# EAGLE board h4k1 (EAGLE 7.2.0), part 1 of 2
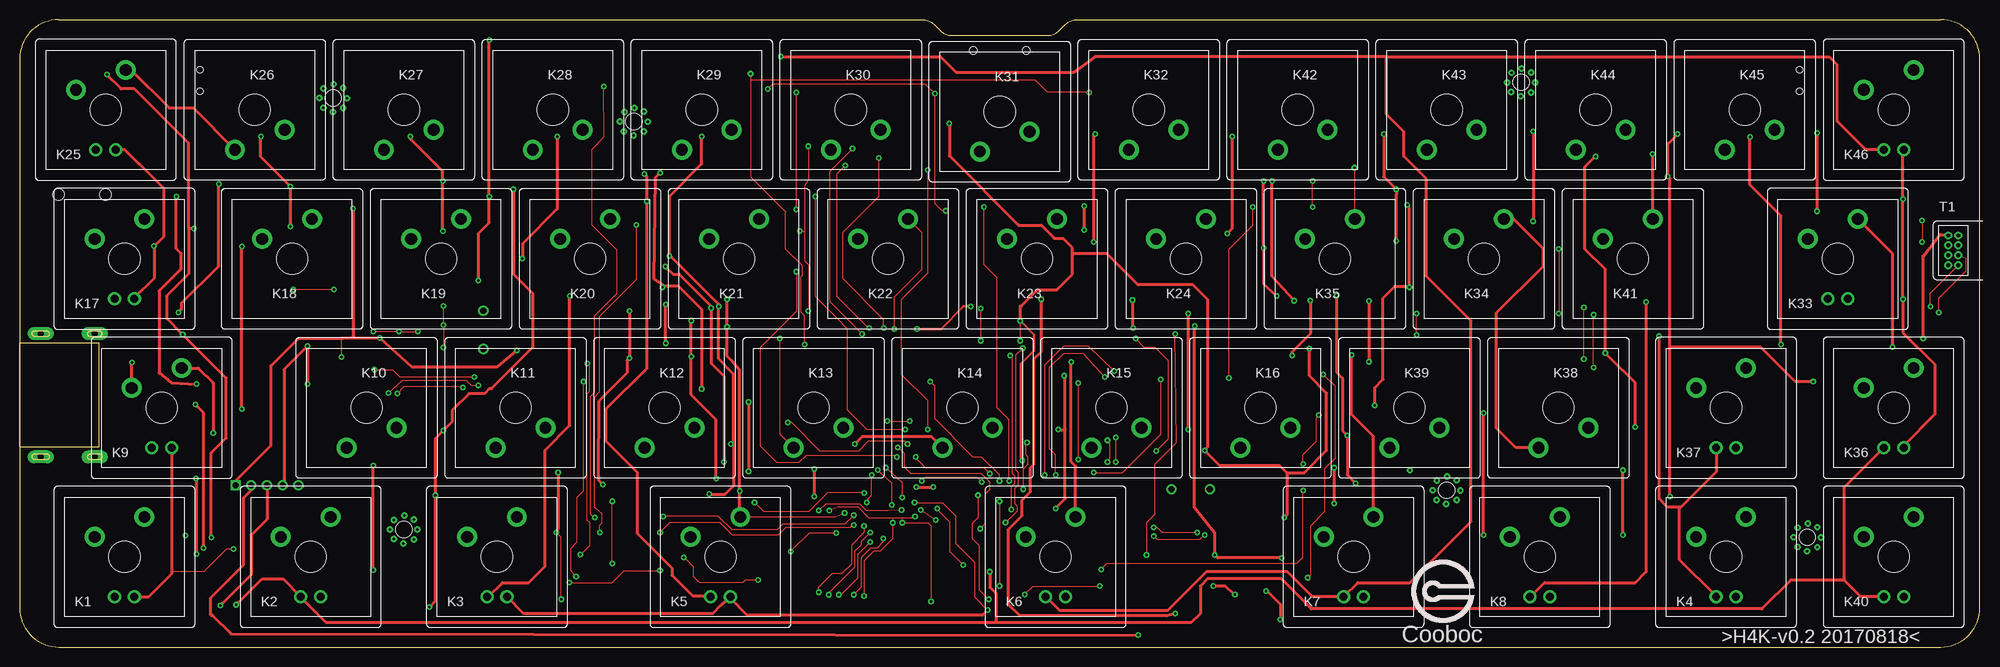
[diagram p5: board, top side]
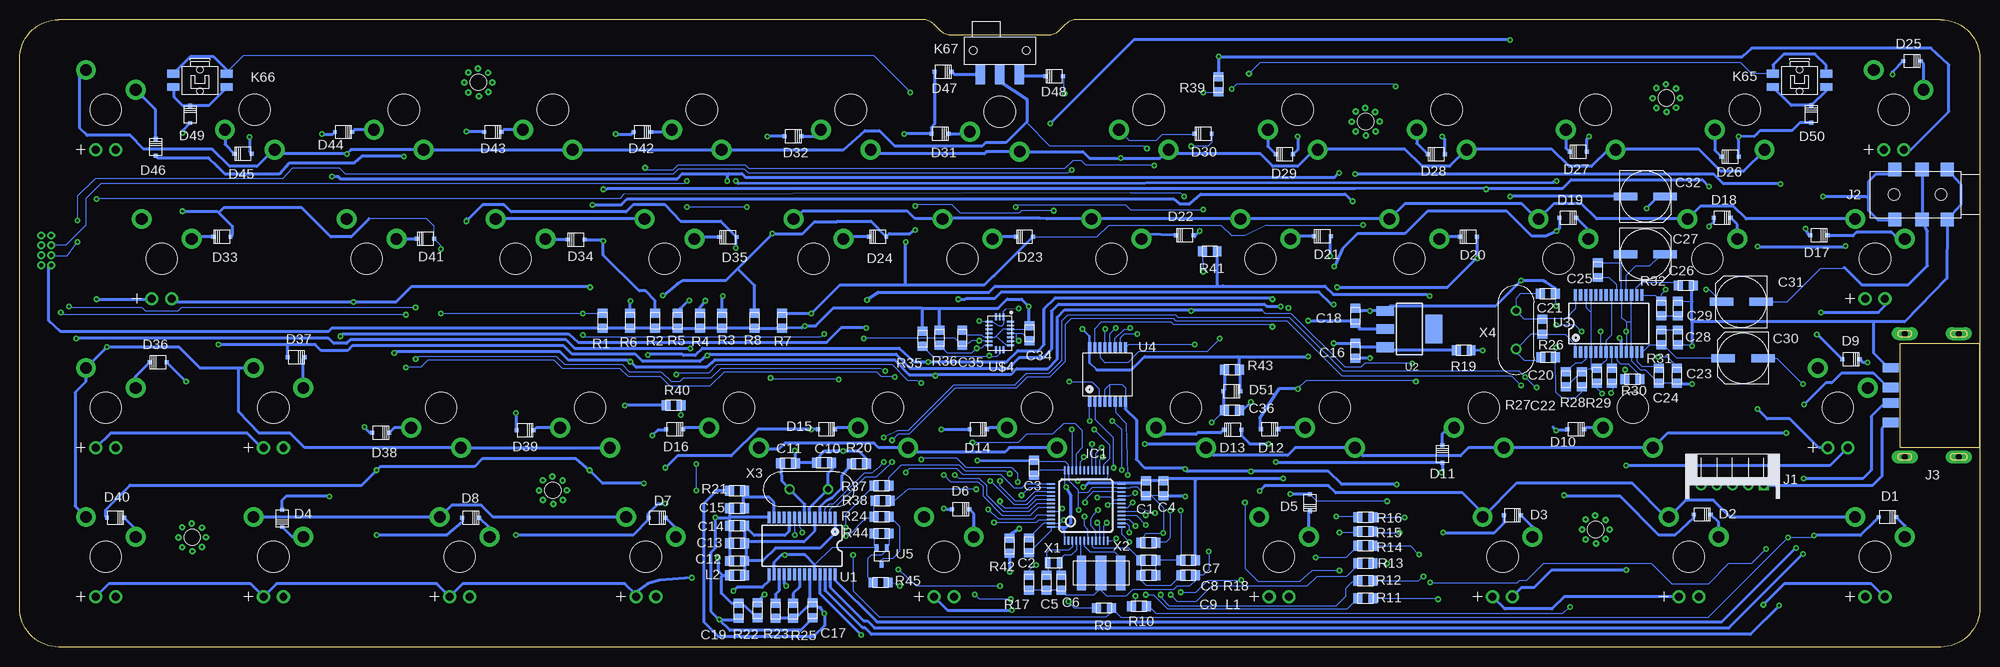
[diagram p6: board, bottom side, seen from below]

Size 250 x 80 mm. Coordinates in mm from the lower left corner, seen from the top.
Outline: 0,75 0,5 arc90 5,0 245,0 arc90 250,5 250,75 arc90 245,80 134.83,80 arc45 133.41,79.41 132.59,78.59 arc-45 131.17,78 118.83,78 arc-45 117.41,78.59 116.59,79.41 arc45 115.17,80 5,80 arc90 0,75
Copper layers (1*16): Top 0.035mm / dielectric 1.5mm / Bottom 0.035mm
Design rules "szjlc": minimum track width 4mil, minimum drill 0.3mm, track to track 6mil, track to pad 6mil, pad to pad 6mil, via to via 6mil, smd to smd 6mil, copper to edge 40mil, drill to drill 8mil, minimum pad ring 10mil, minimum via ring 8mil, stop-mask expansion 4mil, vias tented up to drill 12mil, thermal gap 10mil
Net classes: 0 default: clearance 0.205 mm

## Footprints (pad centres in the part's own frame; a part is rotated, then mirrored left to right if it is on the bottom)
0805 = smd 1.143 x 1.27: P$1 -0.953,0; P$2 0.953,0
CPOL-6.3X5.4 = smd 1 x 3: P$1 0,2.54; P$2 0,-2.54
SOD-323 = smd 0.5 x 0.5: P$1 -1.1,0; P$2 1.1,0
TQFP48 = smd 0.2 x 1: 1 -2.75,-4.5; 2 -2.25,-4.5; 3 -1.75,-4.5; 4 -1.25,-4.5; 5 -0.75,-4.5; 6 -0.25,-4.5; 7 0.25,-4.5; 8 0.75,-4.5; 9 1.25,-4.5; 10 1.75,-4.5; 11 2.25,-4.5; 12 2.75,-4.5; 25 2.75,4.5; 26 2.25,4.5; 27 1.75,4.5; 28 1.25,4.5; 29 0.75,4.5; 30 0.25,4.5; 31 -0.25,4.5; 32 -0.75,4.5; 33 -1.25,4.5; 34 -1.75,4.5; 35 -2.25,4.5; 36 -2.75,4.5 | smd 1 x 0.2: 13 4.5,-2.75; 14 4.5,-2.25; 15 4.5,-1.75; 16 4.5,-1.25; 17 4.5,-0.75; 18 4.5,-0.25; 19 4.5,0.25; 20 4.5,0.75; 21 4.5,1.25; 22 4.5,1.75; 23 4.5,2.25; 24 4.5,2.75; 37 -4.5,2.75; 38 -4.5,2.25; 39 -4.5,1.75; 40 -4.5,1.25; 41 -4.5,0.75; 42 -4.5,0.25; 43 -4.5,-0.25; 44 -4.5,-0.75; 45 -4.5,-1.25; 46 -4.5,-1.75; 47 -4.5,-2.25; 48 -4.5,-2.75
PH-5AWD = drill 0.8 square: P$1 0,4 | drill 0.8: P$2 0,2; P$3 0,0; P$4 0,-2; P$5 0,-4
PJ-313D = smd 1.7 x 1.7: P1 -0.8,-3.2; P1@2 -0.8,3.2; P2 2.4,-3.2; P2@2 2.4,3.2; P3 5.9,-3.2; P3@2 5.9,3.2 | hole 1.5: 0,0; 6,0
USB-AF10 = smd 1.2 x 2: P$D+ 1,11.37; P$D- -1,11.37; P$G 3.5,11.37; P$V -3.5,11.37 | drill 0.8 pad 1.676 long: PS@1 -7.85,2.7; PS@2 7.85,2.7; PS@3 -7.85,9.59; PS@4 7.85,9.59
CHERRY-MX-LED = drill 1.016 pad 1.676: LED_N -1.27,-5.08; LED_P 1.27,-5.08 | drill 1.5 pad 2.54: SW1 -3.81,2.54; SW2 2.54,5.08 | hole 4: 0,0
CHERRY-MX = drill 1.5 pad 2.54: SW1 -3.81,2.54; SW2 2.54,5.08 | hole 4: 0,0
EVQPUL = smd 1.55 x 1: P$1 3.4,0.85; P$2 3.4,-0.85; P$3 -3.4,0.85; P$4 -3.4,-0.85 | hole 0.8: 0,1.375; 0,-1.375
K3-1280S-F2 = smd 1.2 x 2.45: P$1 -2.5,-3.075; P$2 0,-3.075; P$3 2.5,-3.075 | hole 1: -3.4,0; 3.4,0
CLIP-8P-1.27 = drill 0.5: P$1 0,-1.27; P$2 1.27,-1.27; P$3 2.54,-1.27; P$4 3.81,-1.27; P$5 0,0; P$6 1.27,0; P$7 2.54,0; P$8 3.81,0
SSOP28 = smd 0.4 x 1.5: 1 -4.225,-3.625; 2 -3.575,-3.625; 3 -2.925,-3.625; 4 -2.275,-3.625; 5 -1.625,-3.625; 6 -0.975,-3.625; 7 -0.325,-3.625; 8 0.325,-3.625; 9 0.975,-3.625; 10 1.625,-3.625; 11 2.275,-3.625; 12 2.925,-3.625; 13 3.575,-3.625; 14 4.225,-3.625; 15 4.225,3.625; 16 3.575,3.625; 17 2.925,3.625; 18 2.275,3.625; 19 1.625,3.625; 20 0.975,3.625; 21 0.325,3.625; 22 -0.325,3.625; 23 -0.975,3.625; 24 -1.625,3.625; 25 -2.275,3.625; 26 -2.925,3.625; 27 -3.575,3.625; 28 -4.225,3.625
SOT223 = smd 1.219 x 2.235: 1 -2.311,-3.099; 2 0,-3.099; 3 2.311,-3.099 | smd 3.6 x 2.2: 4 0,3.099
SSOP16-208MIL = smd 0.4 x 1.4: P$1 -2.275,-3.4; P$2 -1.625,-3.4; P$3 -0.975,-3.4; P$4 -0.325,-3.4; P$5 0.325,-3.4; P$6 0.975,-3.4; P$7 1.625,-3.4; P$8 2.275,-3.4; P$9 2.275,3.4; P$10 1.625,3.4; P$11 0.975,3.4; P$12 0.325,3.4; P$13 -0.325,3.4; P$14 -0.975,3.4; P$15 -1.625,3.4; P$16 -2.275,3.4
SOT-323 = smd 0.5 x 0.8: P$1 -0.65,-1.1; P$2 0.65,-1.1; P$3 0,1.1
M2-MOUNTING-HOLE = drill 0.305: P$1 0.051,1.753; P$2 1.753,-0.025; P$3 1.27,1.27; P$4 1.27,-1.27; P$5 -0.051,-1.778; P$6 -1.27,-1.245; P$7 -1.778,0; P$8 -1.245,1.219 | hole 2.1: 0,0
BMX055 = smd 0.875 x 0.25: P$1 1.363,1.5; P$2 1.363,1; P$3 1.363,0.5; P$4 1.363,0; P$5 1.363,-0.5; P$6 1.363,-1; P$7 1.363,-1.5; P$11 -1.363,-1.5; P$12 -1.363,-1; P$13 -1.363,-0.5; P$14 -1.363,0; P$15 -1.363,0.5; P$16 -1.363,1; P$17 -1.363,1.5 | smd 0.25 x 0.875: P$8 0.5,-2.112; P$9 0,-2.112; P$10 -0.5,-2.112; P$18 -0.5,2.112; P$19 0,2.112; P$20 0.5,2.112
CRYSTAL-2012 = smd 0.7 x 1.4: P$1 -0.75,0; P$2 0.75,0
7230-RESONATOR = smd 1.2 x 4.4: P$1 -2.5,0; P$3 2.5,0 | smd 1.4 x 4.4: P$2 0,0
49S = drill 0.8: P$1 -2.44,0; P$2 2.44,0

## Placement (x,y rotation side)
C1  4.7uF  [0805]  106.36,20.26 90 bottom
C2  100nF  [0805]  121.28,12.95 270 bottom
C3  100nF  [0805]  120.61,22.87 270 bottom
C4  100nF  [0805]  104.14,20.26 90 bottom
C5  15pF  [0805]  119.06,8.19 90 bottom
C6  15pF  [0805]  117.16,8.19 90 bottom
C7  100nF  [0805]  106.05,13.27 0 bottom
C8  10nF  [0805]  106.05,11.05 180 bottom
C9  1uF  [0805]  106.05,9.14 180 bottom
C10  28pF  [0805]  147.42,23.52 0 bottom
C11  28pF  [0805]  151.99,23.42 180 bottom
C12  100nF  [0805]  158.5,10.97 0 bottom
C13  100nF  [0805]  158.5,13.21 0 bottom
C14  100nF  [0805]  158.5,15.44 0 bottom
C15  100nF  [0805]  158.5,17.68 0 bottom
C16  100nF  [0805]  79.65,37.8 90 bottom
C17  10uF  [0805]  148.89,4.67 90 bottom
C18  100nF  [0805]  79.65,42.27 270 bottom
C19  10uF  [0805]  158.29,4.62 90 bottom
C20  28pF  [0805]  55.07,36.93 180 bottom
C21  28pF  [0805]  55.11,45.07 0 bottom
C22  1uF  [0805]  50.75,34.16 270 bottom
C23  1uF  [0805]  38.63,34.57 90 bottom
C24  1uF  [0805]  40.94,34.57 270 bottom
C25  1uF  [0805]  48.73,48.07 90 bottom
C26  1uF  [0805]  37.53,46.1 0 bottom
C27  47uF  [CPOL-6.3X5.4]  42.66,50.09 270 bottom
C28  22nF  [0805]  38.52,39.47 90 bottom
C29  22nF  [0805]  38.52,43.17 270 bottom
C30  100uF  [CPOL-6.3X5.4]  30.2,36.84 90 bottom
C31  100uF  [CPOL-6.3X5.4]  30.43,44.01 90 bottom
C32  100uF  [CPOL-6.3X5.4]  42.67,57.45 270 bottom
C34  100nF  [0805]  121.18,40.01 90 bottom
C35  100nF  [0805]  129.78,39.42 90 bottom
C36  1uF  [0805]  95.4,30.18 180 bottom
D1  [SOD-323]  11.77,16.58 0 bottom
D2  [SOD-323]  35.41,16.9 0 bottom
D3  [SOD-323]  59.62,16.81 0 bottom
D4  [SOD-323]  216.5,16.41 270 bottom
D5  [SOD-323]  85.46,18.4 270 bottom
D6  [SOD-323]  129.98,17.56 0 bottom
D7  [SOD-323]  168.69,16.5 0 bottom
D8  [SOD-323]  192.48,16.5 0 bottom
D9  [SOD-323]  16.43,36.67 0 bottom
D10  [SOD-323]  51.52,27.8 0 bottom
D11  [SOD-323]  68.53,24.61 90 bottom
D12  [SOD-323]  90.58,27.8 0 bottom
D13  [SOD-323]  95.29,27.71 180 bottom
D14  [SOD-323]  127.72,27.8 0 bottom
D15  [SOD-323]  147.09,27.8 0 bottom
D16  [SOD-323]  166.46,27.8 0 bottom
D17  [SOD-323]  20.52,52.5 0 bottom
D18  [SOD-323]  32.85,54.71 0 bottom
D19  [SOD-323]  52.54,54.71 0 bottom
D20  [SOD-323]  65.25,52.29 180 bottom
D21  [SOD-323]  83.87,52.36 180 bottom
D22  [SOD-323]  101.42,52.49 180 bottom
D23  [SOD-323]  121.84,52.32 180 bottom
D24  [SOD-323]  140.57,52.32 180 bottom
D25  [SOD-323]  8.66,74.72 0 bottom
D26  [SOD-323]  31.86,62.51 180 bottom
D27  [SOD-323]  51.23,63.14 180 bottom
D28  [SOD-323]  69.32,62.83 180 bottom
D29  [SOD-323]  88.69,62.83 180 bottom
D30  [SOD-323]  99.07,65.43 180 bottom
D31  [SOD-323]  132.61,65.44 0 bottom
D32  [SOD-323]  151.34,65.13 0 bottom
D33  [SOD-323]  224.21,52.3 180 bottom
D34  [SOD-323]  179.04,51.96 180 bottom
D35  [SOD-323]  159.68,52.28 180 bottom
D36  [SOD-323]  232.33,36.3 180 bottom
D37  [SOD-323]  214.71,36.94 0 bottom
D38  [SOD-323]  203.94,27.34 0 bottom
D39  [SOD-323]  185.53,27.66 0 bottom
D40  [SOD-323]  237.76,16.49 0 bottom
D41  [SOD-323]  198.25,52.07 180 bottom
D42  [SOD-323]  170.59,65.67 0 bottom
D43  [SOD-323]  189.63,65.67 0 bottom
D44  [SOD-323]  208.69,65.67 0 bottom
D45  [SOD-323]  221.53,62.91 180 bottom
D46  [SOD-323]  232.66,63.73 90 bottom
D47  [SOD-323]  132.22,73.33 0 bottom
D48  [SOD-323]  118.06,72.8 180 bottom
D49  [SOD-323]  228.24,67.92 90 bottom
D50  [SOD-323]  21.49,67.97 90 bottom
D51  [SOD-323]  95.4,32.61 0 bottom
IC1  STM32F10XCXT6  [TQFP48]  113.98,18.03 0 bottom
J1  [PH-5AWD]  31.55,20.62 270 bottom
J2  PJ-313D-AUDIO-JACK  [PJ-313D]  4.97,57.7 180 bottom
J3  USB-AF10  [USB-AF10]  0,32.11 90 bottom
K1  CHERRY-MX-LED  [CHERRY-MX-LED]  13.38,11.5 0 top
K2  CHERRY-MX-LED  [CHERRY-MX-LED]  37.12,11.5 0 top
K3  CHERRY-MX-LED  [CHERRY-MX-LED]  60.88,11.5 0 top
K4  CHERRY-MX-LED  [CHERRY-MX-LED]  217.62,11.5 0 top
K5  CHERRY-MX-LED  [CHERRY-MX-LED]  89.38,11.5 0 top
K6  CHERRY-MX-LED  [CHERRY-MX-LED]  132.12,11.5 0 top
K7  CHERRY-MX-LED  [CHERRY-MX-LED]  170.12,11.5 0 top
K8  CHERRY-MX-LED  [CHERRY-MX-LED]  193.88,11.5 0 top
K9  CHERRY-MX-LED  [CHERRY-MX-LED]  18.12,30.5 0 top
K10  CHERRY-MX  [CHERRY-MX]  44.25,30.5 180 top
K11  CHERRY-MX  [CHERRY-MX]  63.25,30.5 180 top
K12  CHERRY-MX  [CHERRY-MX]  82.25,30.5 180 top
K13  CHERRY-MX  [CHERRY-MX]  101.25,30.5 180 top
K14  CHERRY-MX  [CHERRY-MX]  120.25,30.5 180 top
K15  CHERRY-MX  [CHERRY-MX]  139.25,30.5 180 top
K16  CHERRY-MX  [CHERRY-MX]  158.25,30.5 180 top
K17  CHERRY-MX-LED  [CHERRY-MX-LED]  13.38,49.5 0 top
K18  CHERRY-MX  [CHERRY-MX]  34.75,49.5 0 top
K19  CHERRY-MX  [CHERRY-MX]  53.75,49.5 0 top
K20  CHERRY-MX  [CHERRY-MX]  72.75,49.5 0 top
K21  CHERRY-MX  [CHERRY-MX]  91.75,49.5 0 top
K22  CHERRY-MX  [CHERRY-MX]  110.75,49.5 0 top
K23  CHERRY-MX  [CHERRY-MX]  129.75,49.5 0 top
K24  CHERRY-MX  [CHERRY-MX]  148.75,49.5 0 top
K25  CHERRY-MX-LED  [CHERRY-MX-LED]  11,68.5 0 top
K26  CHERRY-MX  [CHERRY-MX]  30,68.5 180 top
K27  CHERRY-MX  [CHERRY-MX]  49,68.5 180 top
K28  CHERRY-MX  [CHERRY-MX]  68,68.5 180 top
K29  CHERRY-MX  [CHERRY-MX]  87,68.5 180 top
K30  CHERRY-MX  [CHERRY-MX]  106,68.5 180 top
K31  CHERRY-MX  [CHERRY-MX]  125,68.25 180 top
K32  CHERRY-MX  [CHERRY-MX]  144,68.5 180 top
K33  CHERRY-MX-LED  [CHERRY-MX-LED]  231.88,49.5 0 top
K34  CHERRY-MX  [CHERRY-MX]  186.75,49.5 0 top
K35  CHERRY-MX  [CHERRY-MX]  167.75,49.5 0 top
K36  CHERRY-MX-LED  [CHERRY-MX-LED]  239,30.5 0 top
K37  CHERRY-MX-LED  [CHERRY-MX-LED]  217.62,30.5 0 top
K38  CHERRY-MX  [CHERRY-MX]  196.25,30.5 180 top
K39  CHERRY-MX  [CHERRY-MX]  177.25,30.5 180 top
K40  CHERRY-MX-LED  [CHERRY-MX-LED]  239,11.5 0 top
K41  CHERRY-MX  [CHERRY-MX]  205.75,49.5 0 top
K42  CHERRY-MX  [CHERRY-MX]  163,68.5 180 top
K43  CHERRY-MX  [CHERRY-MX]  182,68.5 180 top
K44  CHERRY-MX  [CHERRY-MX]  201,68.5 180 top
K45  CHERRY-MX  [CHERRY-MX]  220,68.5 180 top
K46  CHERRY-MX-LED  [CHERRY-MX-LED]  239,68.5 0 top
K65  EVQPUL02K  [EVQPUL]  23,72.25 180 bottom
K66  EVQPUL02K  [EVQPUL]  227,72.25 180 bottom
K67  K3-1280S-F2  [K3-1280S-F2]  125,76.06 0 bottom
L1  10uH  [0805]  100.97,9.14 0 bottom
L2  10uH  [0805]  158.5,9.14 0 bottom
R1  10k  [0805]  175.63,41.59 270 bottom
R2  10k  [0805]  168.96,41.59 270 bottom
R3  10k  [0805]  160.39,41.59 270 bottom
R4  10k  [0805]  163.25,41.59 270 bottom
R5  10k  [0805]  166.1,41.59 270 bottom
R6  10k  [0805]  172.14,41.59 270 bottom
R7  10k  [0805]  152.77,41.59 270 bottom
R8  10k  [0805]  156.26,41.59 270 bottom
R9  1k  [0805]  111.71,4.98 180 bottom
R10  1k  [0805]  107.24,5.18 180 bottom
R11  1k  [0805]  78.38,6.2 180 bottom
R12  1k  [0805]  78.38,8.43 180 bottom
R13  1k  [0805]  78.38,10.67 180 bottom
R14  1k  [0805]  78.38,12.9 180 bottom
R15  1k  [0805]  78.38,14.73 180 bottom
R16  1k  [0805]  78.38,16.56 180 bottom
R17  10k  [0805]  121.28,8.19 90 bottom
R18  0  [0805]  100.97,11.05 0 bottom
R19  0  [0805]  65.84,37.85 180 bottom
R20  680  [0805]  142.95,23.37 180 bottom
R21  10k  [0805]  158.5,19.91 0 bottom
R22  100k  [0805]  155.91,4.67 270 bottom
R23  100k  [0805]  153.57,4.62 270 bottom
R24  1.5k  [0805]  140.06,16.61 180 bottom
R25  100k  [0805]  151.33,4.62 270 bottom
R26  1M  [0805]  55.78,40.84 90 bottom
R27  1.5k  [0805]  52.79,34.16 90 bottom
R28  1.5k  [0805]  48.84,34.57 90 bottom
R29  22  [0805]  46.94,34.57 90 bottom
R30  22  [0805]  44.32,34.16 0 bottom
R31  10  [0805]  40.65,39.47 270 bottom
R32  10  [0805]  40.65,43.17 90 bottom
R35  4.7k  [0805]  134.86,39.33 90 bottom
R36  4.7k  [0805]  132.68,39.42 90 bottom
R37  15  [0805]  140.06,20.56 180 bottom
R38  15  [0805]  139.97,18.63 180 bottom
R39  200  [0805]  97.1,71.78 90 bottom
R40  200  [0805]  166.61,30.84 180 bottom
R41  200  [0805]  98.22,50.44 0 bottom
R42  200  [0805]  123.77,12.94 270 bottom
R43  1.5k  [0805]  95.4,35.36 180 bottom
R44  10k  [0805]  140.06,14.48 0 bottom
R45  2.2k  [0805]  140.21,8.23 180 bottom
T1  DBG  [CLIP-8P-1.27]  245.95,48.67 90 top
U1  GL850G  [SSOP28]  150.22,12.9 180 bottom
U2  [SOT223]  72.75,40.54 270 bottom
U3  PCM2704CDB  [SSOP28]  47.35,41.25 0 bottom
U4  74HC138  [SSOP16-208MIL]  111.25,34.75 0 bottom
U5  ss8550  [SOT-323]  140.06,11.58 180 bottom
U$1  COOBOC-PLACE  [COOBOC-PLACE]  181.36,5.03 0 top
U$2  M2-MOUNTING-HOLE  [M2-MOUNTING-HOLE]  40,70 0 top
U$3  M2-MOUNTING-HOLE  [M2-MOUNTING-HOLE]  49,15 0 top
U$4  BMX055  [BMX055]  125,40 0 bottom
U$5  M2-MOUNTING-HOLE  [M2-MOUNTING-HOLE]  228,14 0 top
U$6  M2-MOUNTING-HOLE  [M2-MOUNTING-HOLE]  191.5,72 0 top
U$7  M2-MOUNTING-HOLE  [M2-MOUNTING-HOLE]  182,20 0 top
U$8  M2-MOUNTING-HOLE  [M2-MOUNTING-HOLE]  78.35,67 0 top
X1  [CRYSTAL-2012]  118.11,10.73 0 bottom
X2  [7230-RESONATOR]  112.08,9.46 0 bottom
X3  12MHz  [49S]  149.35,20.12 180 bottom
X4  12MHz  [49S]  59.14,40.44 90 bottom